# Altium schematic sheet Sheet1.SchDoc
size A4
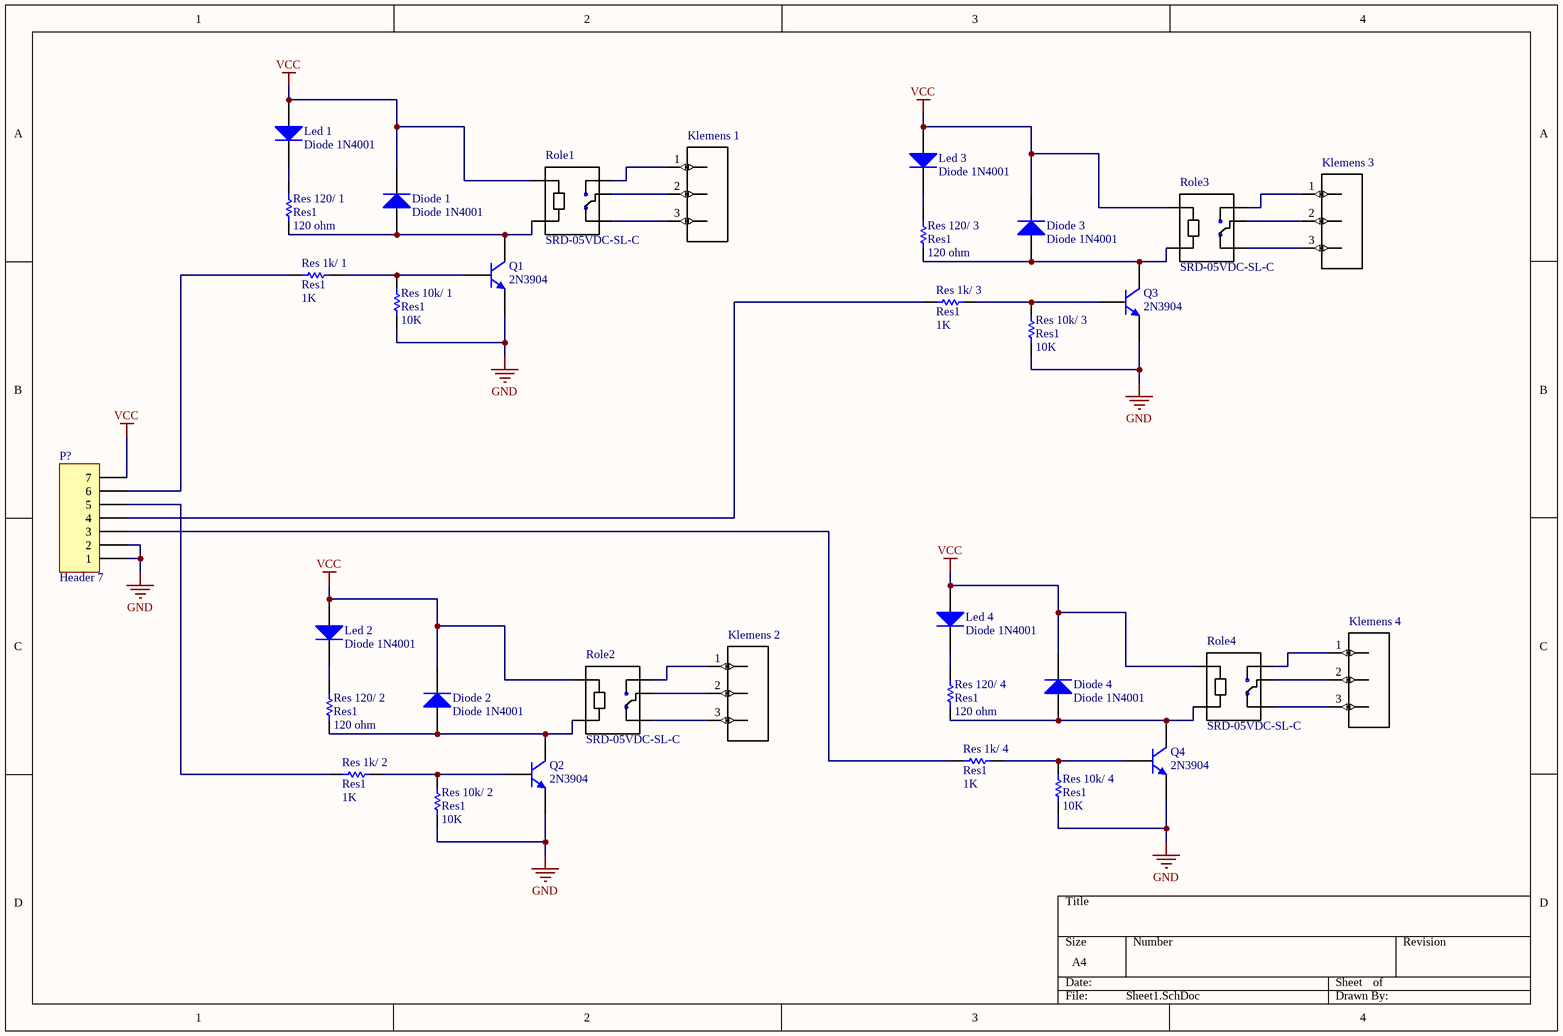
[diagram p0: Sheet1.SchDoc]

## Parts
Diode_1  Diode 1N4001  [DO-41]
Diode_2  Diode 1N4001  [DO-41]
Diode_3  Diode 1N4001  [DO-41]
Diode_4  Diode 1N4001  [DO-41]
Klemens_1  1760520000  [*1760520000]  (value not drawn)
Klemens_2  1760520000  [*1760520000]  (value not drawn)
Klemens_3  1760520000  [*1760520000]  (value not drawn)
Klemens_4  1760520000  [*1760520000]  (value not drawn)
Led_1  Diode 1N4001  [DO-41]
Led_2  Diode 1N4001  [DO-41]
Led_3  Diode 1N4001  [DO-41]
Led_4  Diode 1N4001  [DO-41]
P?  Header 7  [HDR1X7]
Q1  2N3904  [TO-92A]
Q2  2N3904  [TO-92A]
Q3  2N3904  [TO-92A]
Q4  2N3904  [TO-92A]
Res_1k/_1  Res1  value 1K  [AXIAL-0.3]
Res_1k/_2  Res1  value 1K  [AXIAL-0.3]
Res_1k/_3  Res1  value 1K  [AXIAL-0.3]
Res_1k/_4  Res1  value 1K  [AXIAL-0.3]
Res_10k/_1  Res1  value 10K  [AXIAL-0.3]
Res_10k/_2  Res1  value 10K  [AXIAL-0.3]
Res_10k/_3  Res1  value 10K  [AXIAL-0.3]
Res_10k/_4  Res1  value 10K  [AXIAL-0.3]
Res_120/_1  Res1  value 120 ohm  [AXIAL-0.3]
Res_120/_2  Res1  value 120 ohm  [AXIAL-0.3]
Res_120/_3  Res1  value 120 ohm  [AXIAL-0.3]
Res_120/_4  Res1  value 120 ohm  [AXIAL-0.3]
Role1  SRD-05VDC-SL-C  [*RELAY_SRD-05VDC-SL-C_SRD-05VDC-SL-C(Primary)]
Role2  SRD-05VDC-SL-C  [*RELAY_SRD-05VDC-SL-C_SRD-05VDC-SL-C(Primary)]
Role3  SRD-05VDC-SL-C  [*RELAY_SRD-05VDC-SL-C_SRD-05VDC-SL-C(Primary)]
Role4  SRD-05VDC-SL-C  [*RELAY_SRD-05VDC-SL-C_SRD-05VDC-SL-C(Primary)]

## Nets
GND: P?.1 P?.2 Q1.1(E) Q2.1(E) Q3.1(E) Q4.1(E) Res_10k/_1.1 Res_10k/_2.1 Res_10k/_3.1 Res_10k/_4.1
VCC: Diode_1.2(K) Diode_2.2(K) Diode_3.2(K) Diode_4.2(K) Led_1.1(A) Led_2.1(A) Led_3.1(A) Led_4.1(A) P?.7 Role1.A1 Role2.A1 Role3.A1 Role4.A1
NetDiode_1_1: Diode_1.1(A) Q1.3(C) Res_120/_1.1 Role1.A2
NetDiode_2_1: Diode_2.1(A) Q2.3(C) Res_120/_2.1 Role2.A2
NetDiode_3_1: Diode_3.1(A) Q3.3(C) Res_120/_3.1 Role3.A2
NetDiode_4_1: Diode_4.1(A) Q4.3(C) Res_120/_4.1 Role4.A2
NetKlemens_1_1: Klemens_1.1 Role1.NO
NetKlemens_1_2: Klemens_1.2 Role1.COM
NetKlemens_1_3: Klemens_1.3 Role1.NC
NetKlemens_2_1: Klemens_2.1 Role2.NO
NetKlemens_2_2: Klemens_2.2 Role2.COM
NetKlemens_2_3: Klemens_2.3 Role2.NC
NetKlemens_3_1: Klemens_3.1 Role3.NO
NetKlemens_3_2: Klemens_3.2 Role3.COM
NetKlemens_3_3: Klemens_3.3 Role3.NC
NetKlemens_4_1: Klemens_4.1 Role4.NO
NetKlemens_4_2: Klemens_4.2 Role4.COM
NetKlemens_4_3: Klemens_4.3 Role4.NC
NetLed_1_2: Led_1.2(K) Res_120/_1.2
NetLed_2_2: Led_2.2(K) Res_120/_2.2
NetLed_3_2: Led_3.2(K) Res_120/_3.2
NetLed_4_2: Led_4.2(K) Res_120/_4.2
NetP?_3: P?.3 Res_1k/_4.1
NetP?_4: P?.4 Res_1k/_3.1
NetP?_5: P?.5 Res_1k/_2.1
NetP?_6: P?.6 Res_1k/_1.1
NetQ1_2: Q1.2(B) Res_1k/_1.2 Res_10k/_1.2
NetQ2_2: Q2.2(B) Res_1k/_2.2 Res_10k/_2.2
NetQ3_2: Q3.2(B) Res_1k/_3.2 Res_10k/_3.2
NetQ4_2: Q4.2(B) Res_1k/_4.2 Res_10k/_4.2

## Library data of the parts
Diode_1-Diode_4 Led_1-Led_4 = Diode 1N4001: 1 Amp General Purpose Rectifier; Published: 8-Jun-2000; LatestRevisionDate: 17-Jul-2002; LatestRevisionNote: Re-released for DXP Platform.; DatasheetVersion: 1998; PackageVersion: Aug-1999; PackageReference: DO-41; Publisher: Altium Limited; PackageDescription: Diode, Axial; Body 5.2 x 2.7 mm (LxDia. max), Lead Dia. 0.86 mm (max); Code_JEDEC: DO-204-AL; ComponentLink1Description: Manufacturer Link; ComponentLink1URL: http://www.fairchildsemi.com/; ComponentLink2Description: Datasheet; ComponentLink2URL: http://www.fairchildsemi.com/ds/1N%2F1N4001.pdf
Klemens_1-Klemens_4 = 1760520000: Conn Terminal Block 3 POS 5.08mm Solder ST Thru-Hole 16A; MF: Weidmuller; SnapEDA_Link: https://www.snapeda.com/parts/1760520000/Weidmuller/view-part/?ref=snap; Availability: Unavailable; MP: 1760520000; Package: None; Price: None; Value: *
P? = Header 7: Header, 7-Pin; LatestRevisionDate: 17-Jul-2002; LatestRevisionNote: Re-released for DXP Platform.; Publisher: Altium Limited
Q1-Q4 = 2N3904: NPN General Purpose Amplifier; Published: 8-Jun-2000; LatestRevisionDate: 15-Jan-2003; LatestRevisionNote: PCB Footprint 'BCY-W3/D4.7' replaced; DatasheetVersion: 1997; PackageVersion: Sep-1998; PackageReference: TO-92A; Publisher: Altium Limited; PackageDescription: TO, Flat Index; 3 In-Line, Axial Leads; Body Dia. 4.5mm; Leads 0.51 x 0.48 mm (max); ComponentLink1Description: Manufacturer Link; ComponentLink1URL: http://www.fairchildsemi.com/; ComponentLink2Description: Datasheet; ComponentLink2URL: http://www.fairchildsemi.com/ds/2N%2F2N3904.pdf
Res_1k/_1-Res_1k/_4 Res_10k/_1-Res_10k/_4 Res_120/_1-Res_120/_4 = Res1: Resistor; Published: 8-Jun-2000; LatestRevisionDate: 17-Jul-2002; LatestRevisionNote: Re-released for DXP Platform.; PackageReference: AXIAL-0.3; Publisher: Altium Limited; PackageDescription: Axial Device, Thru-Hole; 2 Leads; 0.3 in Pin Spacing
Role1-Role4 = SRD-05VDC-SL-C: 5V Trigger Relay Module For Arduino And Raspberry Pi 5V Trigger Relay Module For Arduino And Raspberry Pi; MF: Songle Relay; Availability: Unavailable; Package: None; Price: None; SnapEDA_Link: https://www.snapeda.com/parts/SRD-05VDC-SL-C/Songle%20Relay/view-part/?ref=snap; MP: SRD-05VDC-SL-C; Value: *